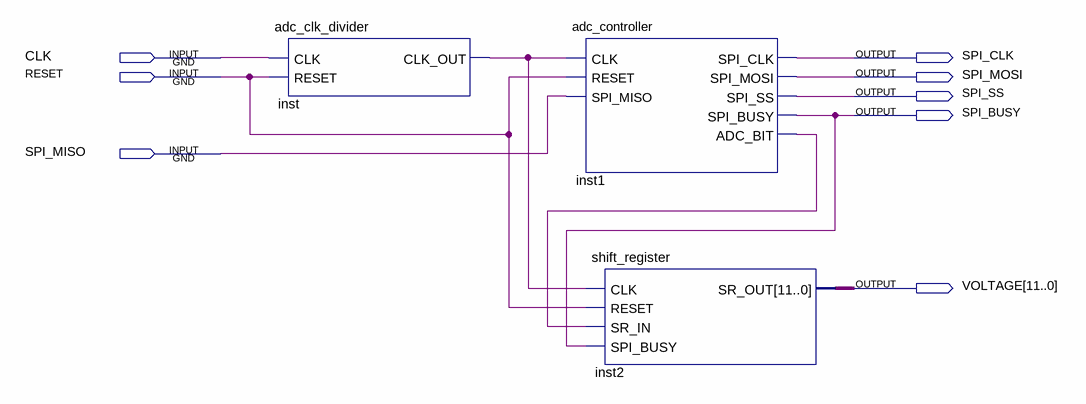
[diagram p0: schematic sheet]
// Quartus schematic adc_full.bdf as structural Verilog: 3 symbols, 8 pins
module adc_full (
  input  CLK,
  input  RESET,
  input  SPI_MISO,
  output SPI_CLK,
  output SPI_MOSI,
  output SPI_SS,
  output SPI_BUSY,
  output [11:0] VOLTAGE
);

  wire inst1_adc_bit, inst_clk_out;

  adc_clk_divider inst (.CLK(CLK), .RESET(RESET), .CLK_OUT(inst_clk_out));
  adc_controller inst1 (
    .CLK(inst_clk_out), .RESET(RESET), .SPI_MISO(SPI_MISO), .SPI_CLK(SPI_CLK), .SPI_MOSI(SPI_MOSI),
    .SPI_SS(SPI_SS), .SPI_BUSY(SPI_BUSY), .ADC_BIT(inst1_adc_bit));
  shift_register inst2 (
    .CLK(inst_clk_out), .RESET(RESET), .SR_IN(inst1_adc_bit), .SPI_BUSY(SPI_BUSY), .SR_OUT(VOLTAGE));
endmodule
